# EAGLE design as5040 (EAGLE 6.5.0)
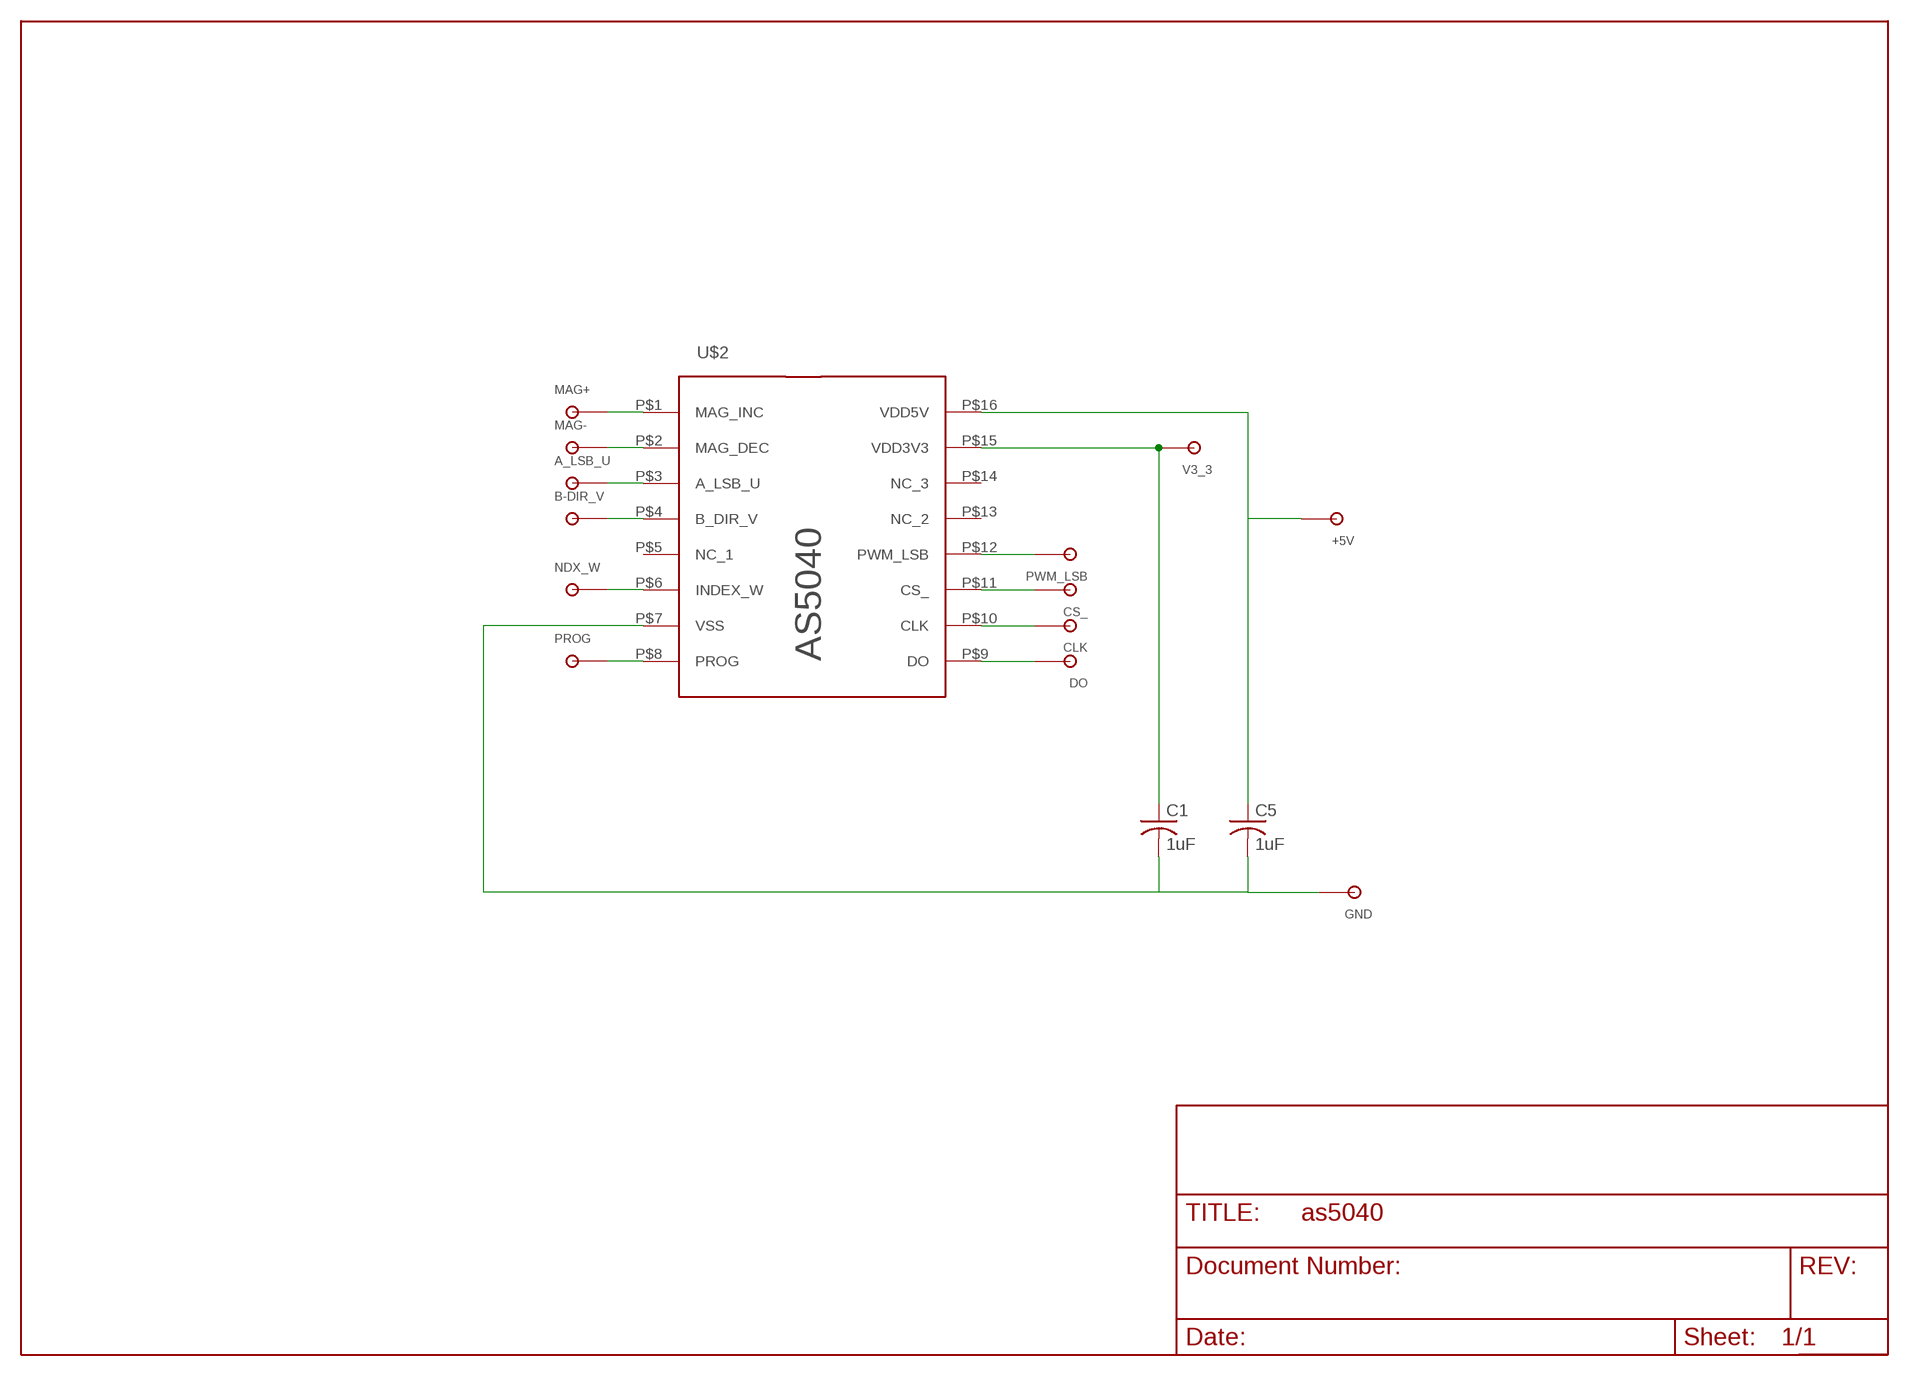
[diagram p0: schematic, sheet 1]

## Parts
+5V  TPSOL  [TP_SOL]
A_LSB_U  TPSOL  [TP_SOL]
B-DIR_V  TPSOL  [TP_SOL]
C1  1uF  C-USC0805K  [C0805K]
C5  1uF  C-USC0805K  [C0805K]
CLK  TPSOL  [TP_SOL]
CS_  TPSOL  [TP_SOL]
DO  TPSOL  [TP_SOL]
GND  TPSOL  [TP_SOL]
MAG+  TPSOL  [TP_SOL]
MAG-  TPSOL  [TP_SOL]
NDX_W  TPSOL  [TP_SOL]
PROG  TPSOL  [TP_SOL]
PWM_LSB  TPSOL  [TP_SOL]
U$2  AS5040  [AMS_5040_SPECIAL]
V3_3  TPSOL  [TP_SOL]

## Nets
N$2: C1.2 C5.2 GND.P$1 U$2.P$7(VSS)
N$3: +5V.P$1 C5.1 U$2.P$16(VDD5V)
N$4: C1.1 U$2.P$15(VDD3V3) V3_3.P$1
N$5: MAG+.P$1 U$2.P$1(MAG_INC)
N$6: MAG-.P$1 U$2.P$2(MAG_DEC)
N$7: A_LSB_U.P$1 U$2.P$3(A_LSB_U)
N$8: B-DIR_V.P$1 U$2.P$4(B_DIR_V)
N$9: NDX_W.P$1 U$2.P$6(INDEX_W)
N$10: PROG.P$1 U$2.P$8(PROG)
N$11: PWM_LSB.P$1 U$2.P$12(PWM_LSB)
N$12: CS_.P$1 U$2.P$11(CS_)
N$13: CLK.P$1 U$2.P$10(CLK)
N$14: DO.P$1 U$2.P$9(DO)
Unconnected: U$2.P$5(NC_1) U$2.P$13(NC_2) U$2.P$14(NC_3)

## Library data of the parts
+5V A_LSB_U B-DIR_V CLK CS_ DO GND MAG+ MAG- NDX_W PROG PWM_LSB V3_3 = wifi_WX:TP
C1 C5 = rcl:C-US: CAPACITOR, American symbol
U$2 = 1AA_Stofer:AS5040: 10Bit 360° Programmable Magnetic Rotary Encoder

## Board
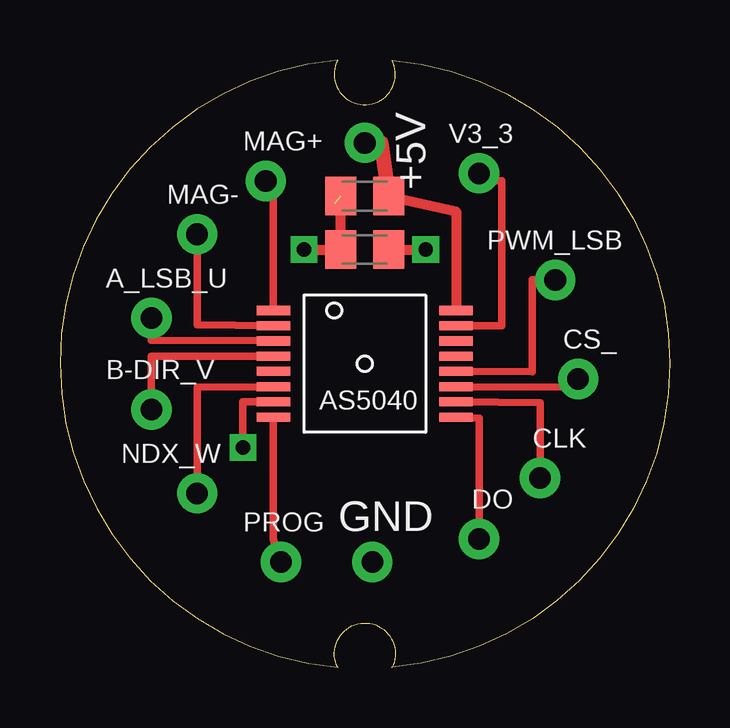
[diagram p1: board, top side]
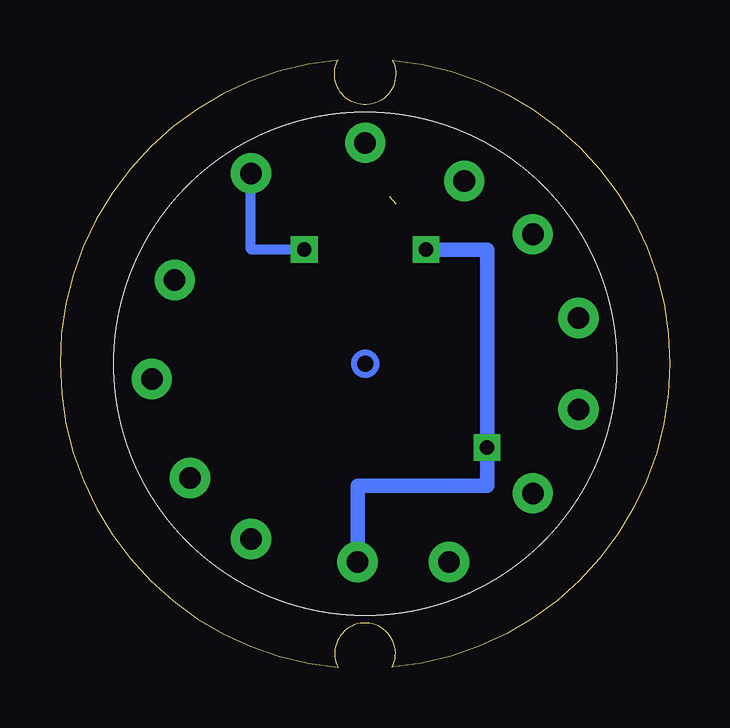
[diagram p2: board, bottom side, seen from below]

Size 25.41 x 25.32 mm. Coordinates in mm from the lower left corner, seen from the top.
Outline: 11.57,25.32 arc170 11.58,0.02
Outline: 11.57,25.32 arc235 13.83,25.32
Outline: 13.83,25.32 arc-170 13.82,0.01
Outline: 11.57,0.02 arc-235 13.83,0
Copper layers (1*16): Top 0.035mm / dielectric 1.5mm / Bottom 0.035mm
Design rules "sparkfun": minimum track width 8mil, minimum drill 20mil, track to track 8mil, track to pad 8mil, pad to pad 8mil, via to via 8mil, smd to smd 8mil, copper to edge 10mil, drill to drill 8mil, minimum pad ring 12mil, minimum via ring 10mil, stop-mask expansion 4mil, vias tented up to drill 25mil, thermal gap 10mil

### Footprints (pad centres in the part's own frame; a part is rotated, then mirrored left to right if it is on the bottom)
TP_SOL = drill 0.9 pad 1.676: P$1 0,0
C0805K = smd 1.3 x 1.6: 1 -1,0; 2 1,0
AMS_5040_SPECIAL = smd 0.381 x 1.397: P$1 0,-0.635; P$2 0.635,-0.635; P$3 1.27,-0.635; P$4 1.905,-0.635; P$5 2.54,-0.635; P$6 3.175,-0.635; P$7 3.81,-0.635; P$8 4.445,-0.635; P$9 4.445,6.985; P$10 3.81,6.985; P$11 3.175,6.985; P$12 2.54,6.985; P$13 1.905,6.985; P$14 1.27,6.985; P$15 0.635,6.985; P$16 0,6.985

### Placement (x,y rotation side)
+5V  12.7,21.87 0 top
A_LSB_U  3.81,14.57 0 top
B-DIR_V  3.81,10.76 0 top
C1  12.7,17.43 180 top
C5  12.7,19.65 180 top
CLK  20,7.9 0 top
CS_  21.59,12.03 0 top
DO  17.46,5.36 0 top
GND  13.02,4.41 0 top
MAG+  8.57,20.28 0 top
MAG-  5.71,18.06 0 top
NDX_W  5.71,7.27 0 top
PROG  9.21,4.41 0 top
PWM_LSB  20.64,16.16 0 top
U$2  9.52,14.89 270 top
V3_3  17.46,20.6 0 top

### Tracks (layer width: path | path; a pad name or v marks a point on that pad's centre or on a via)
N$2  (via drill 0.6)  (1 unrouted)
  Top 0.305: U$2.P$7 7.62,11.08 v7.62,9.17 | 11.38,17.43 11.43,17.74 | 11.43,19.33 11.38,19.33
  Top 0.406: v10.16,17.43 11.38,17.43 C1.2 | C1.2 11.43,17.43 11.43,17.74 | C1.2 C5.2
  Bottom 0.61: v10.16,17.43 7.62,17.43 v7.62,9.17 7.62,7.58 13.02,7.58 GND.P$1
N$3
  Top 0.406: C5.1 16.51,19.01 U$2.P$16
  Top 0.61: +5V.P$1 13.38,21.87 C5.1
N$4  (via drill 0.6)
  Top 0.305: U$2.P$15 18.41,14.25 18.41,20.28 17.46,20.28 V3_3.P$1
  Top 0.406: C1.1 v15.24,17.43
  Bottom 0.406: v15.24,17.43 17.46,17.43 V3_3.P$1
N$5
  Top 0.305: U$2.P$1 8.89,20.28 MAG+.P$1 8.51,20.28
N$6
  Top 0.305: U$2.P$2 5.71,14.29 MAG-.P$1
N$7
  Top 0.305: U$2.P$3 3.81,13.64 A_LSB_U.P$1
N$8
  Top 0.305: U$2.P$4 3.81,12.99 B-DIR_V.P$1
N$9
  Top 0.305: U$2.P$6 5.71,11.69 NDX_W.P$1
N$10
  Top 0.305: U$2.P$8 8.89,5.36 PROG.P$1 9.21,3.77
N$11
  Top 0.305: U$2.P$12 19.68,12.34 19.68,16.16 PWM_LSB.P$1
N$12
  Top 0.305: U$2.P$11 21.59,11.69 CS_.P$1
N$13
  Top 0.305: U$2.P$10 20,11.04 CLK.P$1
N$14
  Top 0.305: U$2.P$9 17.46,10.39 DO.P$1
(copper drawn outside any net)
  shapes: Bottom circle x1

### Text on the board
tPlace: +5V | AS5040